# Altium schematic sheet Photodiode Input Board Schematic.SchDoc
size A; SheetNumber: 1; SheetTotal: 2
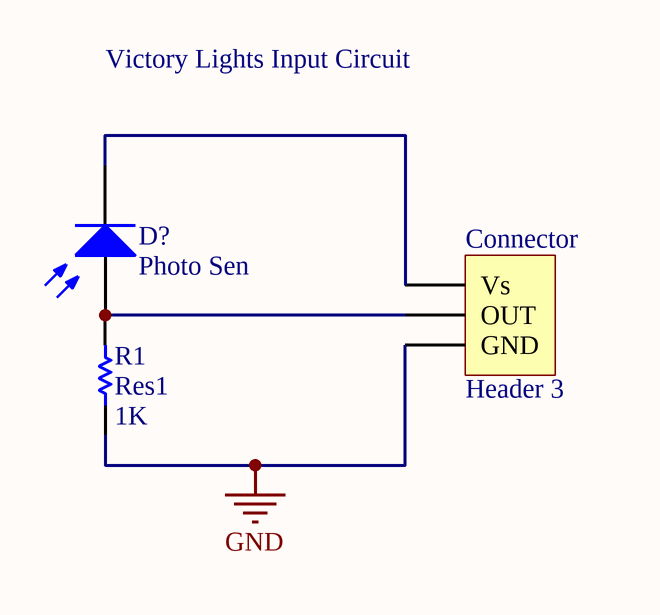
[diagram p0: Photodiode Input Board Schematic.SchDoc]

## Parts
Connector  Header 3  [HDR1X3]
D?  Photo Sen  [PIN2]
R1  Res1  value 1K  [AXIAL-0.3]

## Nets
GND: Connector.3(GND) R1.1
NetConnector_1: Connector.1(Vs) D?.2(K)
NetConnector_2: Connector.2(OUT) D?.1(A) R1.2

## Notes on the sheet
- Victory Lights Input Circuit

## Library data of the parts
Connector = Header 3: Header, 3-Pin; LatestRevisionDate: 17-Jul-2002; LatestRevisionNote: Re-released for DXP Platform.; Publisher: Altium Limited
D? = Photo Sen: Photosensitive Diode; Published: 24-Mar-1999; LatestRevisionDate: 17-Jul-2002; LatestRevisionNote: Re-released for DXP Platform.; PackageReference: PIN2; Publisher: Altium Limited
R1 = Res1: Resistor; Published: 8-Jun-2000; LatestRevisionDate: 17-Jul-2002; LatestRevisionNote: Re-released for DXP Platform.; PackageReference: AXIAL-0.3; Publisher: Altium Limited; PackageDescription: Axial Device, Thru-Hole; 2 Leads; 0.3 in Pin Spacing